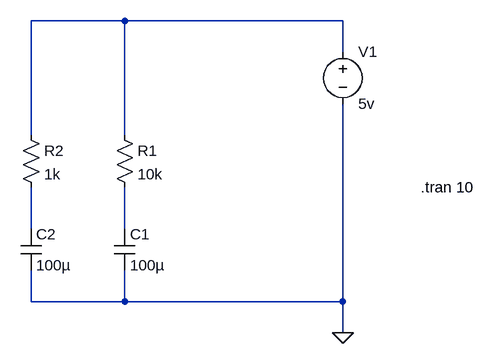
[diagram p0: schematic 37#24.5_2.(2).asc]
37#24.5_2.(2).asc, the LTspice schematic file:
Version 4
SHEET 1 880 680
WIRE -128 -432 -272 -432
WIRE 208 -432 -128 -432
WIRE 208 -384 208 -432
WIRE -272 -256 -272 -432
WIRE -128 -256 -128 -432
WIRE -272 -112 -272 -176
WIRE -128 -112 -128 -176
WIRE -272 0 -272 -48
WIRE -128 0 -128 -48
WIRE -128 0 -272 0
WIRE 208 0 208 -304
WIRE 208 0 -128 0
WIRE 208 48 208 0
FLAG 208 48 0
SYMBOL voltage 208 -400 R0
WINDOW 123 0 0 Left 2
WINDOW 39 0 0 Left 2
SYMATTR InstName V1
SYMATTR Value 5v
SYMBOL res -144 -272 R0
SYMATTR InstName R1
SYMATTR Value 10k
SYMBOL cap -144 -112 R0
SYMATTR InstName C1
SYMATTR Value 100µ
SYMBOL res -288 -272 R0
SYMATTR InstName R2
SYMATTR Value 1k
SYMBOL cap -288 -112 R0
SYMATTR InstName C2
SYMATTR Value 100µ
TEXT 328 -176 Left 2 !.tran 10

The netlist it stands for:
* 37#24.5_2.(2).asc
V1 N001 0 5v
R1 N001 N003 10k
C1 N003 0 100µ
R2 N001 N002 1k
C2 N002 0 100µ
.tran 10
.backanno
.end